# EAGLE design Seeeduino_XIAO_Expansion_board_v1.0_200824 (EAGLE 9.3.1)
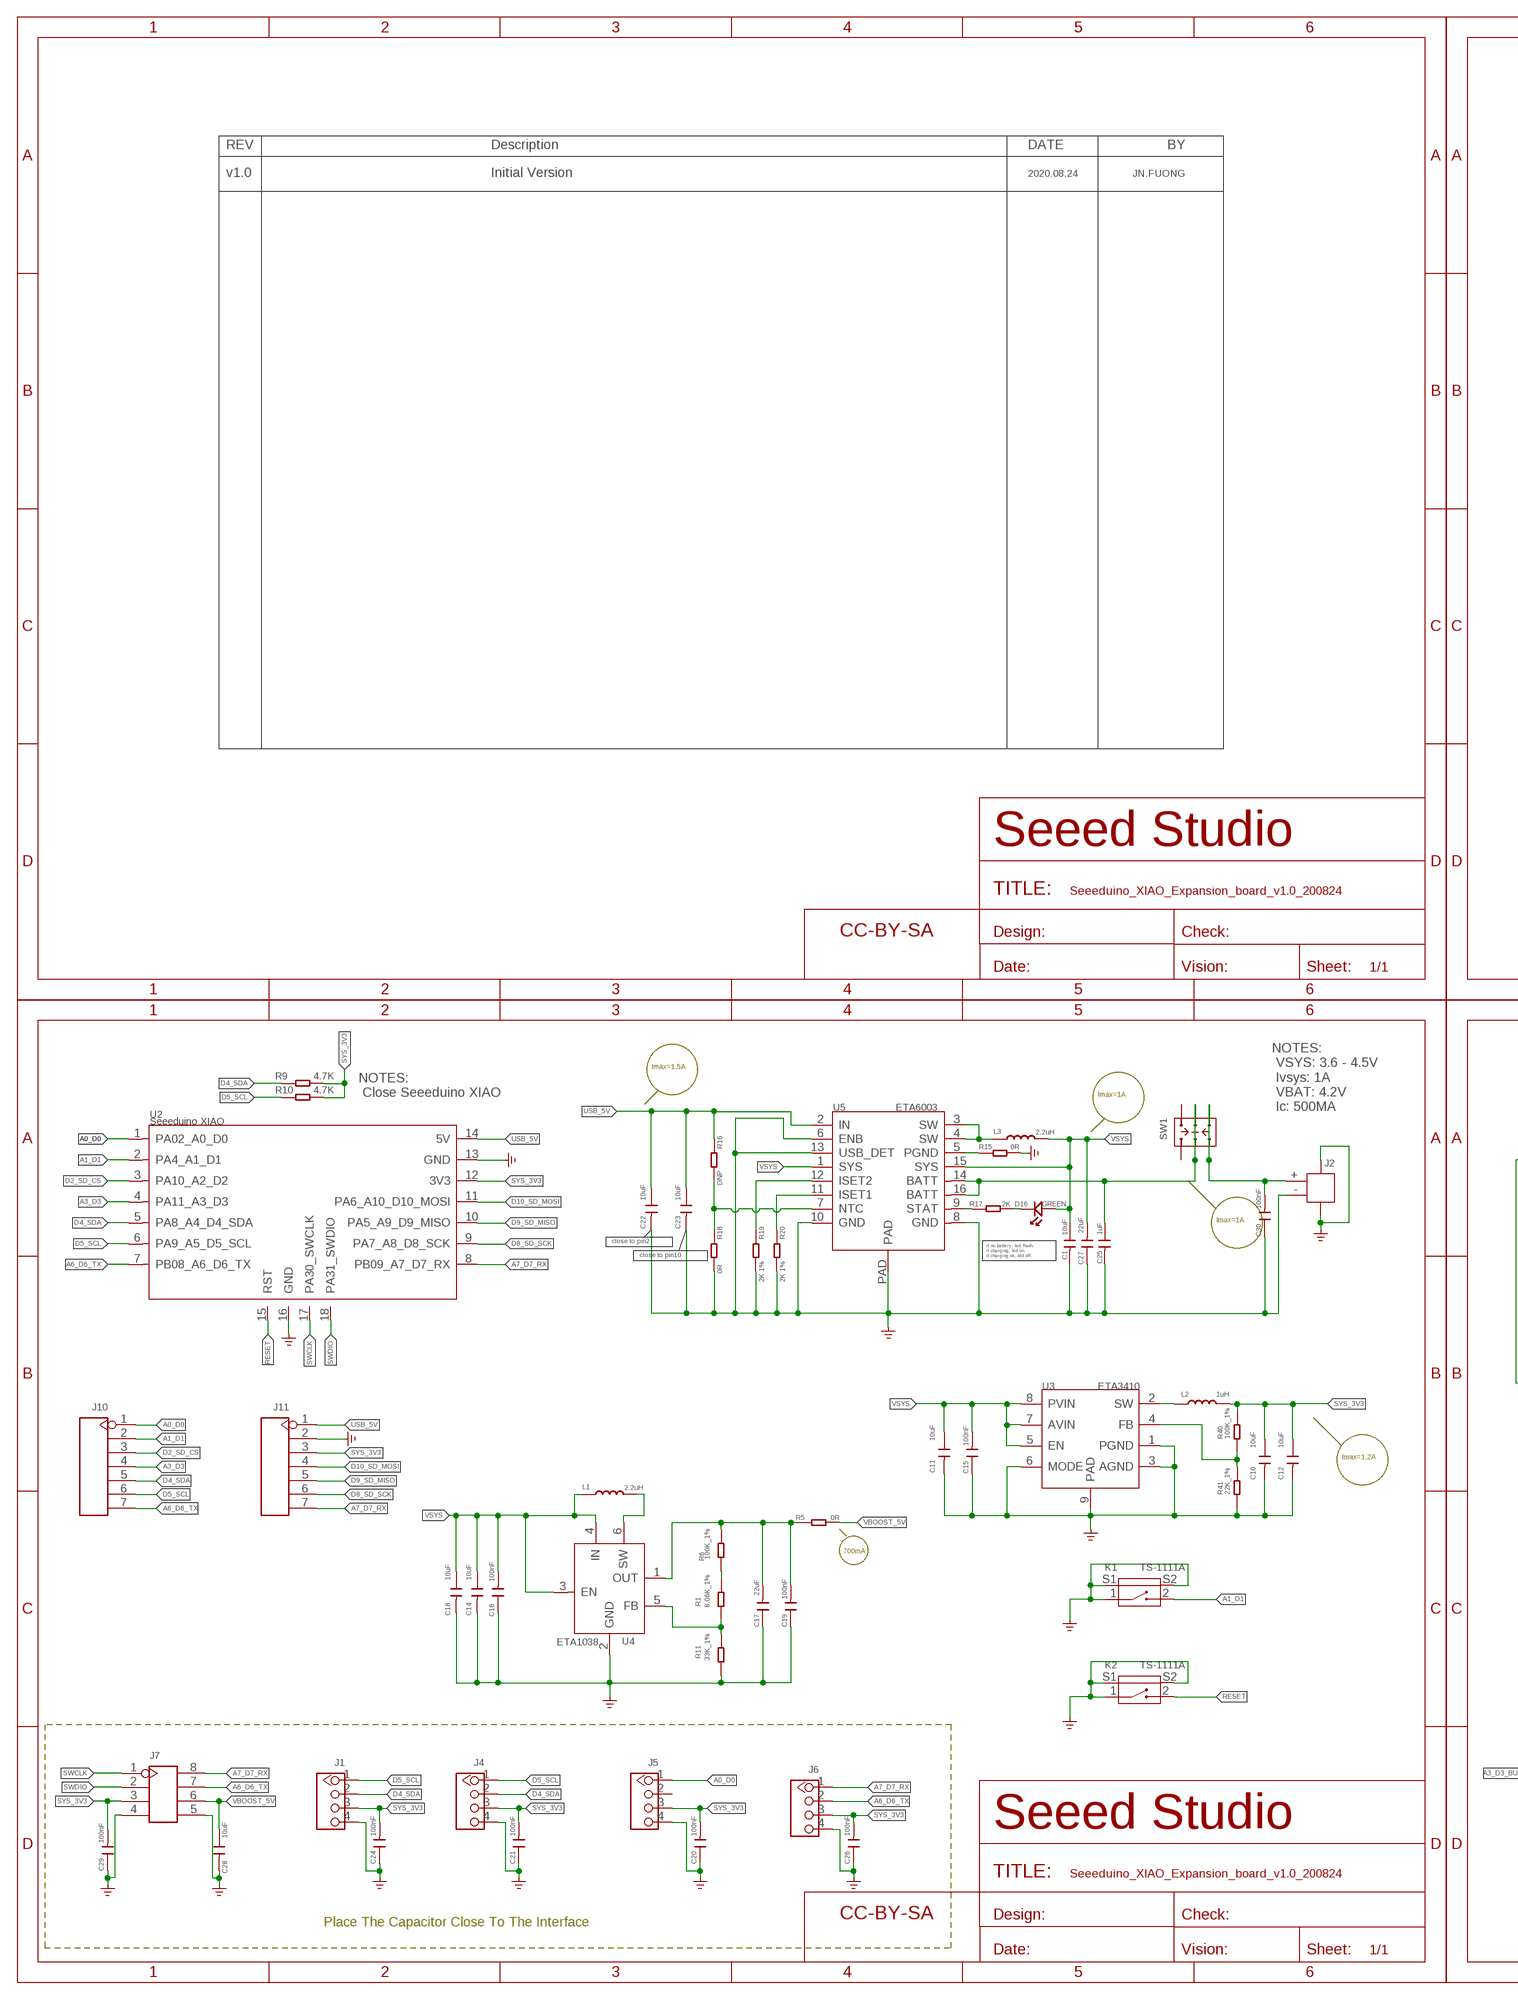
[diagram p0: schematic, sheet 1, part 1 of 2]
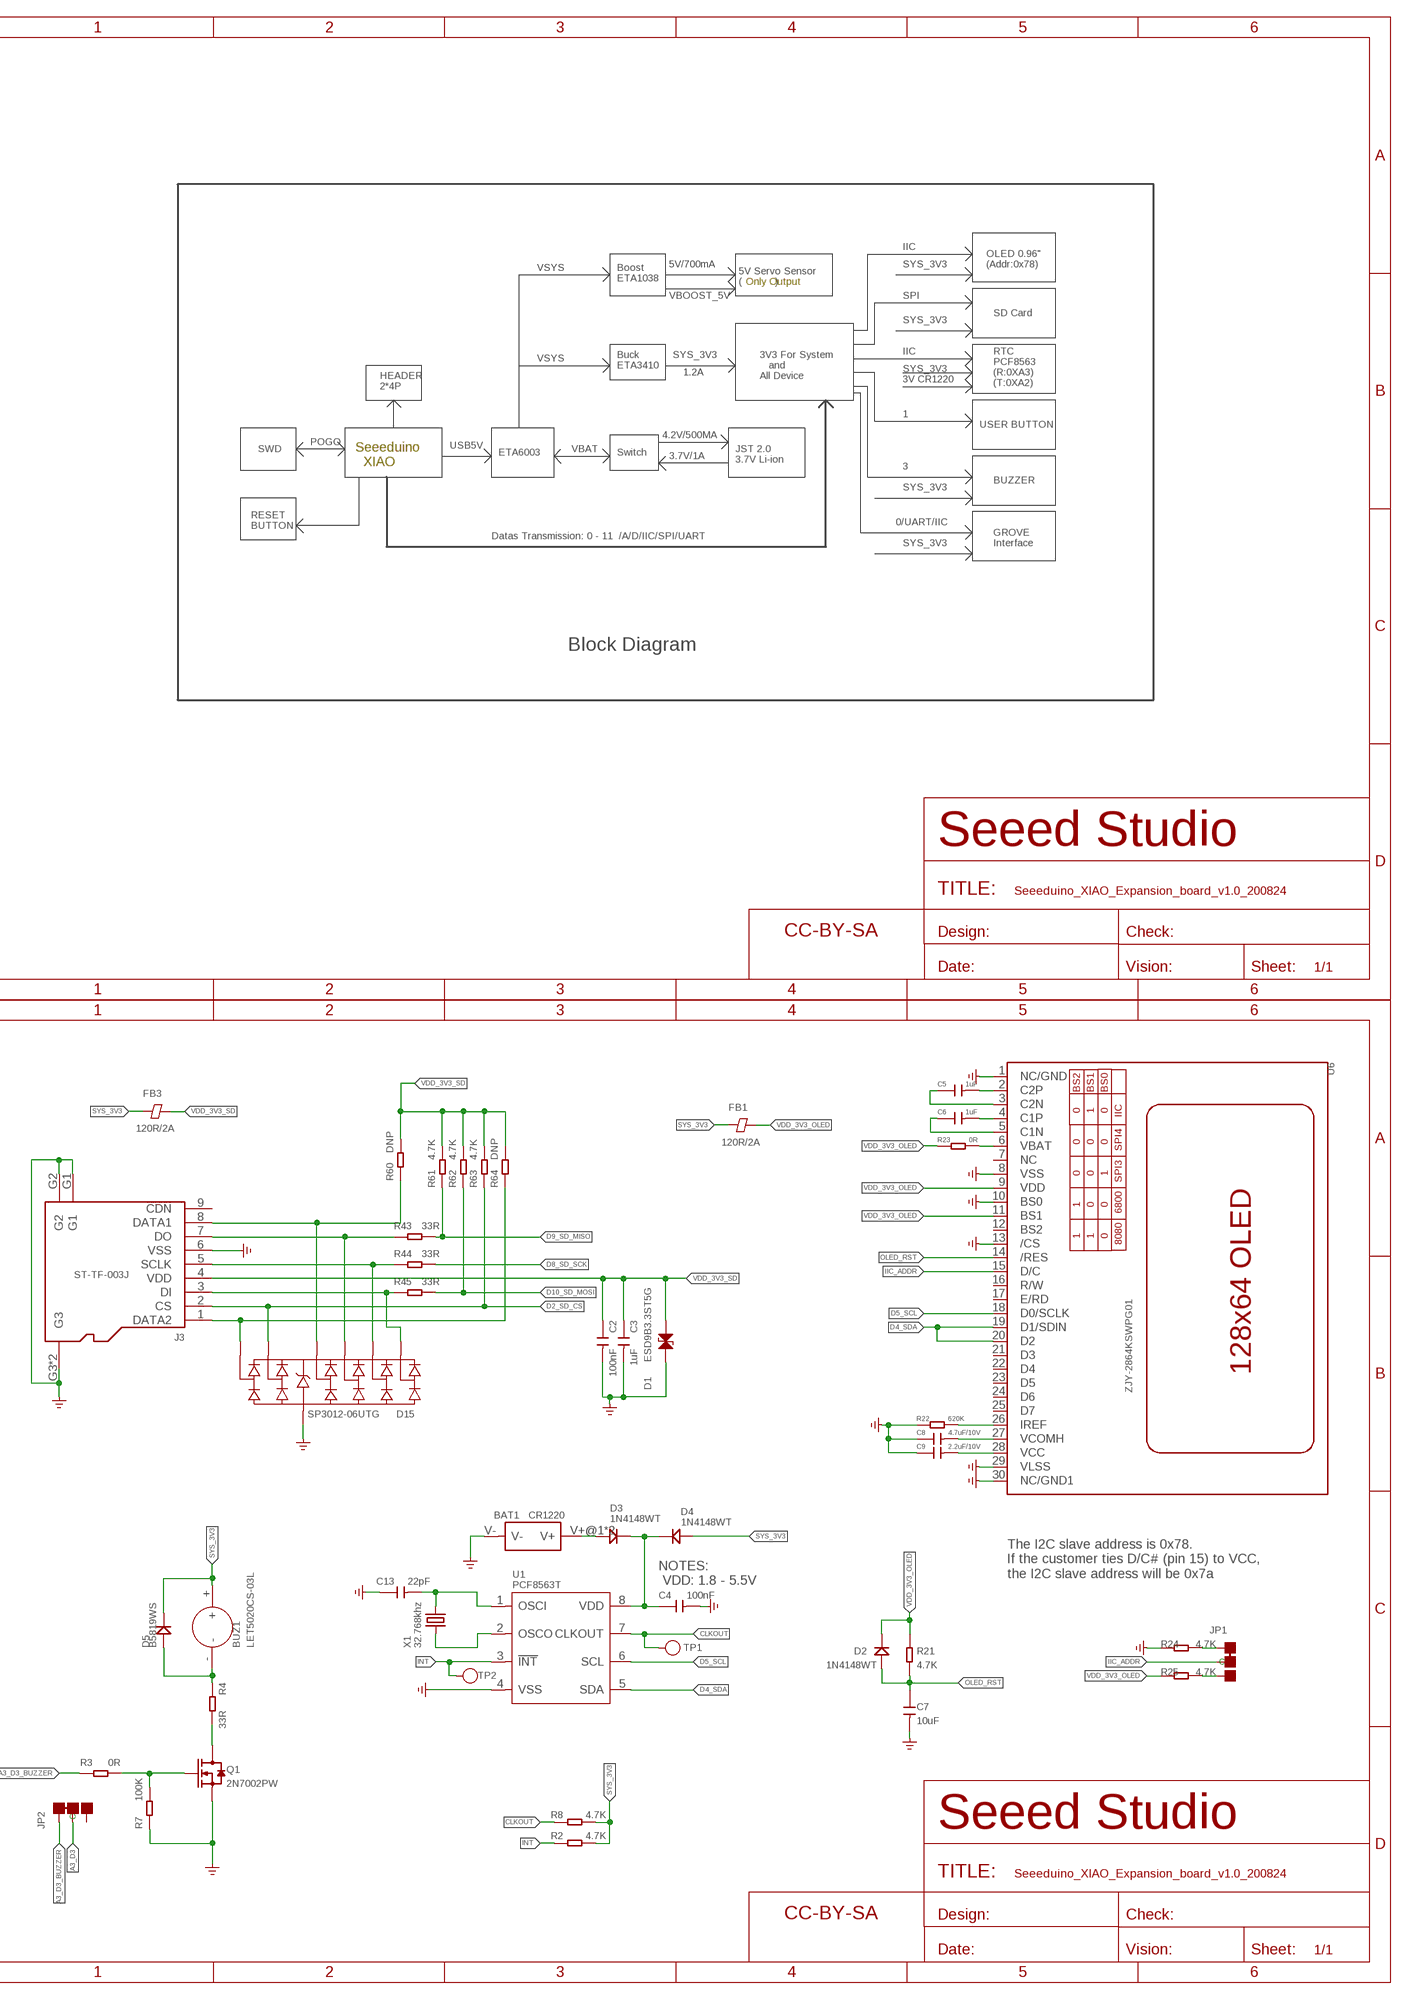
[diagram p1: schematic, sheet 1, part 2 of 2]

## Parts
BAT1  CR1220  BAT-HOLDER-KST-1206  [BAT2P-SMD-13.2X12.1X3.2MM]
BUZ1  LET5020CS-03L  BUZZER-312020004  [BZ3-SMD-5.0X5.0X2.5MM]
C1  10uF  C-0603  [C0603]
C2  100nF  C-0402  [C0402]
C3  1uF  C-0402  [C0402]
C4  100nF  C-0402  [C0402]
C5  1uF  C-0402  [C0402]
C6  1uF  C-0402  [C0402]
C7  10uF  C-0603  [C0603]
C8  4.7uF/10V  C-0603  [C0603]
C9  2.2uF/10V  C-0603  [C0603]
C10  10uF  C-0603  [C0603]
C11  10uF  C-0603  [C0603]
C12  10uF  C-0603  [C0603]
C13  22pF  C-0402  [C0402]
C14  10uF  C-0603  [C0603]
C15  100nF  C-0402  [C0402]
C16  100nF  C-0402  [C0402]
C17  22uF  C-0603  [C0603]
C18  10uF  C-0603  [C0603]
C19  100nF  C-0402  [C0402]
C20  100nF  C-0402  [C0402]
C21  100nF  C-0402  [C0402]
C22  10uF  C-0603  [C0603]
C23  10uF  C-0603  [C0603]
C24  100nF  C-0402  [C0402]
C25  1uF  C-0402  [C0402]
C26  100nF  C-0402  [C0402]
C27  22uF  C-0603  [C0603]
C28  10uF  C-0603  [C0603]
C29  100nF  C-0402  [C0402]
C30  100nF  C-0603  [C0603]
D1  ESD9B3.3ST5G  D-ESD-2P-DOUBLE-0402  [ESD-0402]
D2  1N4148WT  DIODE'0603'  [SOD-523]
D3  1N4148WT  DIODE'0603'  [SOD-523]
D4  1N4148WT  DIODE'0603'  [SOD-523]
D5  B5819WS  DIODE'0805'  [SOD-323]
D15  SP3012-06UTG  D-ESD-14P  [UDFN14-0.5-3.5X1.35X0.5MM]
D16  GREEN  LED-0402  [LED-0402]
FB1  120R/2A  FERRITE-BEAD-0402  [F0402]
FB3  120R/2A  FERRITE-BEAD-0402  [F0402]
FR1  SEEEDSTUDIO-OPEN-SCH-FRAME  [SEEEDSTUDIO-PCB-FRAME]
FR2  SEEEDSTUDIO-OPEN-SCH-FRAME  [SEEEDSTUDIO-PCB-FRAME]
FR3  SEEEDSTUDIO-OPEN-SCH-FRAME  [SEEEDSTUDIO-PCB-FRAME]
FR5  SEEEDSTUDIO-OPEN-SCH-FRAME  [SEEEDSTUDIO-PCB-FRAME]
J1  GROVE-CONNECTOR-DIP-320110034  [HW4-2.0-90D]
J2  JST-2P-SMD'2.0'  [HW2-SMD-2.0-90D]
J3  ST-TF-003J  MICRO-SD-CARD-HOLDER-9P-320090000  [MICRO-SD9+4P-SMD-16.1X14.5X1.85MM]
J4  GROVE-CONNECTOR-DIP-320110034  [HW4-2.0-90D]
J5  GROVE-CONNECTOR-DIP-320110034  [HW4-2.0-90D]
J6  GROVE-CONNECTOR-DIP-320110034  [HW4-2.0-90D]
J7  HEADER-2X4P-2.54-SMD  [H2X4-SMD-2.54]
J10  HEADER-7P-2.54  [H7-2.54]
J11  HEADER-7P-2.54  [H7-2.54]
JP1  JP-3P-SHORT  [3P-SMD-SHORT]
JP2  JP-3P-SHORT  [3P-SMD-SHORT]
K1  TS-1111A  BUTTON-2+2P'HQ-TP-1100A'  [SW4-SMD-4.5X3.8X1.8MM-90D]
K2  TS-1111A  BUTTON-2+2P'HQ-TP-1100A'  [SW4-SMD-4.5X3.8X1.8MM-90D]
L1  2.2uH  INDUCTOR/FERRITE-BEAD'0806'  [L0806]
L2  1uH  L-MPM201610SR33_T  [L201610]
L3  2.2uH  INDUCTOR/FERRITE-BEAD'0806'  [L0806]
Q1  2N7002PW  MOSFET-N-SI1304BDL  [SOT-323]
R1  8.06K_1%  R-0402  [R0402]
R2  4.7K  R-0402  [R0402]
R3  0R  R-0402  [R0402]
R4  33R  R-0402  [R0402]
R5  0R  R-0603  [R0603]
R6  100K_1%  R-0402  [R0402]
R7  100K  R-0402  [R0402]
R8  4.7K  R-0402  [R0402]
R9  4.7K  R-0402  [R0402]
R10  4.7K  R-0402  [R0402]
R11  33K_1%  R-0402  [R0402]
R15  0R  R-0402  [R0402]
R16  DNP  R-0402  [R0402]
R17  2K  R-0402  [R0402]
R18  0R  R-0402  [R0402]
R19  2K 1%  R-0402  [R0402]
R20  2K 1%  R-0402  [R0402]
R21  4.7K  R-0402  [R0402]
R22  620K  R-0402  [R0402]
R23  0R  R-0402  [R0402]
R24  4.7K  R-0402  [R0402]
R25  4.7K  R-0402  [R0402]
R40  100K_1%  R-0402  [R0402]
R41  22K_1%  R-0402  [R0402]
R43  33R  R-0402  [R0402]
R44  33R  R-0402  [R0402]
R45  33R  R-0402  [R0402]
R60  DNP  R-0402  [R0402]
R61  4.7K  R-0402  [R0402]
R62  4.7K  R-0402  [R0402]
R63  4.7K  R-0402  [R0402]
R64  DNP  R-0402  [R0402]
SW1  SWITCH-2CH-6P-311030004  [SW6-2.54-9.0X3.5X3.2MM-90D]
TP1  TEST-POINT'4545'  [TP-D45MIL]
TP2  TEST-POINT'4545'  [TP-D45MIL]
U1  PCF8563T  RTC-PCF8563T  [SOP8-1.27-5X3.9MM]
U2  Seeeduino XIAO  MOUDLE-SEEEDUINO-XIAO-TEST-DIP  [MOUDLE14P-2.54-21X17.8MM-TEST]
U3  ETA3410  CONVERTER-ETA3410  [DFN8G-0.5-2X2MM]
U4  ETA1038  CONVERTER-ETA1038  [SOT-23-6]
U5  ETA6003  PMIC-ETA6003-310990023  [QFN16GA-0.5-3X3MM]
U6  ZJY-2864KSWPG01  OLED-12864-30P  [OLED30P-0.7-24.74X16.9MM]
X1  32.768khz  CRYSTAL-2P'NX2012SA'  [X2-SMD-L2.0X1.2X0.55MM]

## Nets
A0_D0: J5.1 J10.1 U2.1(PA02_A0_D0)
A1_D1: J10.2 K1.2 U2.2(PA4_A1_D1)
A3_D3: J10.4 JP2.MM(C) U2.4(PA11_A3_D3)
A3_D3_BUZZER: JP2.11(L) R3.1
A6_D6_TX: J6.2 J7.7 J10.7 U2.7(PB08_A6_D6_TX)
A7_D7_RX: J6.1 J7.8 J11.7 U2.8(PB09_A7_D7_RX)
CLKOUT: R8.1 TP1.T U1.7(CLKOUT)
D2_SD_CS: D15.6 D15.9 J3.2(CS) J10.3 R63.1 U2.3(PA10_A2_D2)
D4_SDA: J1.2 J4.2 J10.5 R9.1 U1.5(SDA) U2.5(PA8_A4_D4_SDA) U6.19(D1/SDIN) U6.20(D2)
D5_SCL: J1.1 J4.1 J10.6 R10.1 U1.6(SCL) U2.6(PA9_A5_D5_SCL) U6.18(D0/SCLK)
D8_SD_SCK: J11.6 R44.2 U2.9(PA7_A8_D8_SCK)
D9_SD_MISO: J11.5 R43.2 R61.1 U2.10(PA5_A9_D9_MISO)
D10_SD_MOSI: J11.4 R45.2 R62.1 U2.11(PA6_A10_D10_MOSI)
E_VBAT: C30.2 J2.+ SW1.CH1B SW1.CH2B
GND: BAT1.V- C1.2 C2.2 C3.2 C4.2 C7.2 C8.1 C9.1 C10.2 C11.2 C12.2 C13.1 C14.2 C15.1 C16.1 C17.1 C18.2 C19.1 C20.1 C21.1 C22.2 C23.2 C24.1 C25.2 C26.1 C27.1 C28.2 C29.1 C30.1 D1.1 D15.5 D15.10 J1.4 J2.3 J2.4 J2.- J3.6(VSS) J3.G1 J3.G2 J3.G3 J3.G4(G3) J4.4 J5.4 J6.4 J7.4 J7.5 J11.2 K1.1 K1.S1 K1.S2 K2.1 K2.S1 K2.S2 Q1.2(S) R7.1 R11.2 R15.2 R18.2 R19.2 R20.2 R22.2 R24.1 R41.1 U1.4(VSS) U2.13(GND) U2.16(GND) U3.1(PGND) U3.3(AGND) U3.6(MODE) U3.9(PAD) U4.2(GND) U5.6(ENB) U5.8(GND) U5.10(GND) U5.13(USB_DET) U5.PAD U6.1(NC/GND) U6.8(VSS) U6.10(BS0) U6.13(/CS) U6.29(VLSS) U6.30(NC/GND1) ; supply symbol labelled GND_POWER
IIC_ADDR: JP1.MM(C) U6.15(D/C)
INT: R2.1 TP2.T U1.3(!INT)
N$1: L1.2 U4.6(SW)
N$5: BAT1.V+@1(V+) BAT1.V+@2(V+) D3.+
N$6: Q1.3(D) R4.2
N$7: BUZ1.- D5.+ R4.1
N$8: Q1.1(G) R3.2 R7.2
N$9: C5.2 U6.2(C2P)
N$10: C13.2 U1.1(OSCI) X1.2
N$11: U1.2(OSCO) X1.1
N$12: C6.2 U6.4(C1P)
N$13: C5.1 U6.3(C2N)
N$14: C6.1 U6.5(C1N)
N$15: R22.1 U6.26(IREF)
N$16: C8.2 U6.27(VCOMH)
N$17: C9.2 U6.28(VCC)
N$18: R23.2 U6.6(VBAT)
N$19: JP1.11(L) R24.2
N$20: JP1.00(R) R25.2
N$21: R40.1 R41.2 U3.4(FB)
N$22: C17.2 C19.2 R5.2 R6.1 U4.1(OUT)
N$23: C4.1 D3.- D4.- U1.8(VDD)
N$24: R1.1 R6.2
N$26: L3.1 U5.3(SW) U5.4(SW)
N$27: R1.2 R11.1 U4.5(FB)
N$29: L2.1 U3.2(SW)
N$30: D16.- R17.1
N$31: R17.2 U5.9(STAT)
N$33: R16.2 R18.1 U5.7(NTC)
N$34: R20.1 U5.11(ISET1)
N$36: R19.1 U5.12(ISET2)
N$37: R15.1 U5.5(PGND)
N$64: D15.1 D15.14 J3.8(DATA1) R60.1
N$72: D15.7 D15.8 J3.1(DATA2) R64.1
N$76: D15.2 D15.13 J3.7(DO) R43.1
N$77: D15.3 D15.12 J3.5(SCLK) R44.1
N$78: D15.4 D15.11 J3.3(DI) R45.1
OLED_RST: C7.1 D2.+ R21.1 U6.14(/RES)
RESET: K2.2 U2.15(RST)
SWCLK: J7.1 U2.17(PA30_SWCLK)
SWDIO: J7.2 U2.18(PA31_SWDIO)
SYS_3V3: BUZ1.+ C10.1 C12.1 C20.2 C21.2 C24.2 C26.2 C29.2 D4.+ D5.- FB1.1 FB3.1 J1.3 J4.3 J5.3 J6.3 J7.3 J11.3 L2.2 R2.2 R8.2 R9.2 R10.2 R40.2 U2.12(3V3)
USB_5V: C22.1 C23.1 J11.1 R16.1 U2.14(5V) U5.2(IN)
VBAT: C25.1 SW1.COM1 SW1.COM2 U5.14(BATT) U5.16(BATT)
VBOOST_5V: C28.1 J7.6 R5.1
VDD_3V3_OLED: D2.- FB1.2 R21.2 R23.1 R25.1 U6.9(VDD) U6.11(BS1)
VDD_3V3_SD: C2.1 C3.1 D1.2 FB3.2 J3.4(VDD) R60.2 R61.2 R62.2 R63.2 R64.2
VSYS: C1.1 C11.1 C14.1 C15.2 C16.2 C18.1 C27.2 D16.+ L1.1 L3.2 U3.5(EN) U3.7(AVIN) U3.8(PVIN) U4.3(EN) U4.4(IN) U5.1(SYS) U5.15(SYS)
Unconnected: J3.9(CDN) J5.2 JP2.00(R) SW1.CH1A SW1.CH2A U6.7(NC) U6.12(BS2) U6.16(R/W) U6.17(E/RD) U6.21(D3) U6.22(D4) U6.23(D5) U6.24(D6) U6.25(D7)

## Notes on the sheet
- v1.0 | Initial Version | 2020.08.24 | JN.FUONG
- IIC
- VSYS
- 5V/700mA | SYS_3V3
- OLED 0.96"
  (Addr:0x78)
- Boost
  ETA1038
- 5V Servo Sensor
  (           )
- Only Output
- VBOOST_5V | SPI
- SD Card
- SYS_3V3
- VSYS | IIC
- SYS_3V3
- Buck
  ETA3410
- SYS_3V3
- 1.2A
- 3V3 For System
     and
  All Device
- 3V CR1220
- RTC
  PCF8563
  (R:0XA3)
  (T:0XA2)
- HEADER
  2*4P
- 1
- USER BUTTON
- 4.2V/500MA
- POGO
- USB5V
- SWD | VBAT
- ETA6003 | Switch
- 3.7V/1A
- JST 2.0
  3.7V Li-ion
- Seeeduino
    XIAO
- 3
- BUZZER
- SYS_3V3
- 0/UART/IIC
- RESET
  BUTTON
- Datas Transmission: 0 - 11  /A/D/IIC/SPI/UART
- SYS_3V3
- GROVE
  Interface
- Block Diagram
- Imax=1.5A
- NOTES:
   Close Seeeduino XIAO
- Imax=1A
- NOTES:
   VSYS: 3.6 - 4.5V
   Ivsys: 1A
   VBAT: 4.2V
   Ic: 500MA
- Imax=1A
- close to pin2
- close to pin10
- if no battery, led flash.
  if charging, led on.
  if charging ok, led off.
- Imax=1.2A
- 700mA
- The I2C slave address is 0x78.
  If the customer ties D/C# (pin 15) to VCC,
  the I2C slave address will be 0x7a
- NOTES:
   VDD: 1.8 - 5.5V
- Place The Capacitor Close To The Interface

## Library data of the parts
BAT1 = Connector-new:BAT-HOLDER: BAT2P-13.5-CR1220:320170002;BAT2P-SMD-20.5-CR1632:320170007;METAL-CR2032-D20.0*H6.3MM:320170003;METAL-CR2032-SMD:320170006;PLASTIC-CR1220-L15.06*W13.0*H4.1MM:320170000;PLASTIC-CR2032-L25.2*W15.6*H5.2MM:320170005;BAT2P-11.55-D12.55-CR1220:313010022
BUZ1 = Discrete-new:BUZZER
C1-C30 = Discrete-small:C*: Ceramic Capacitors
D1 = Discrete-small:D-ESD-2P-DOUBLE
D2-D5 = Discrete-new:DIODE
D15 = Discrete-new:D-ESD-14P
D16 = Discrete-small:LED
FB1 FB3 = Discrete-new:FERRITE-BEAD
FR1-FR3 FR5 = moudle-new:SEEEDSTUDIO-OPEN-SCH-FRAME
J1 J4-J6 = Connector-new:GROVE-CONNECTOR-DIP
J2 = Connector-new:JST-2P-SMD
J3 = Connector-new:MICRO-SD-CARD-HOLDER-9P; SKU: 320090000
J7 = Connector-new:HEADER-2X4P
J10 J11 = Connector-new:HEADER-7P
JP1 JP2 = Discrete-new:JP-3P-SHORT
K1 K2 = Discrete-new:BUTTON-2+2P: SW4-SMD-4.5X3.8X1.8MM-90D:311020035;SW4-SMD-7.0X3.5X3.5MM-90D:311020023
L1 L3 = Discrete-new:INDUCTOR/FERRITE-BEAD
L2 = Discrete-new:L
Q1 = Discrete-new:MOSFET-N: IRLL014: http://www.vishay.com/docs/91319/sihll014.pdf
R1-R11 R15-R25 R40 R41 R43-R45 R60-R64 = Discrete-small:R*
SW1 = Switch:SWITCH-2CH-6P
TP1 TP2 = Discrete-new:TEST-POINT; PARTNO: DNP
U1 = IC-new:RTC-PCF8563T
U2 = moudle-new:MOUDLE-SEEEDUINO-XIAO-TEST
U3 = IC-new:CONVERTER-ETA3410: 3MHZ 2A High Step-Down Converter in DFN2x2-8L Package
U4 = IC-new:CONVERTER-ETA1038
U5 = IC-new:PMIC-ETA6003
U6 = moudle-new:OLED-128*64-30P: 308020008
X1 = Discrete-new:CRYSTAL-2P

## Board
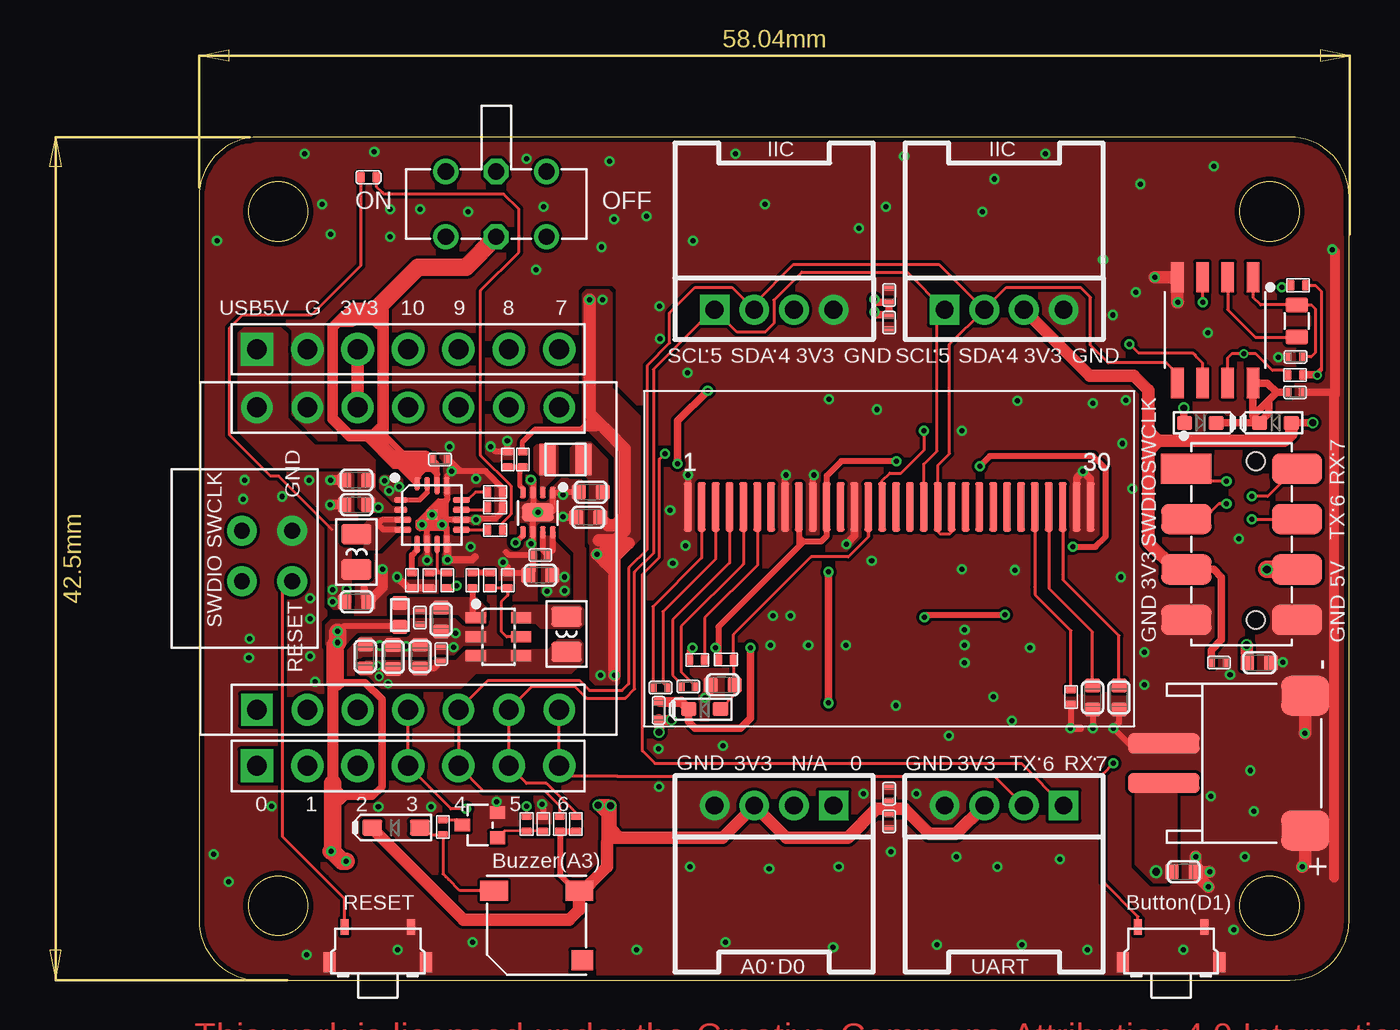
[diagram p2: board, top side]
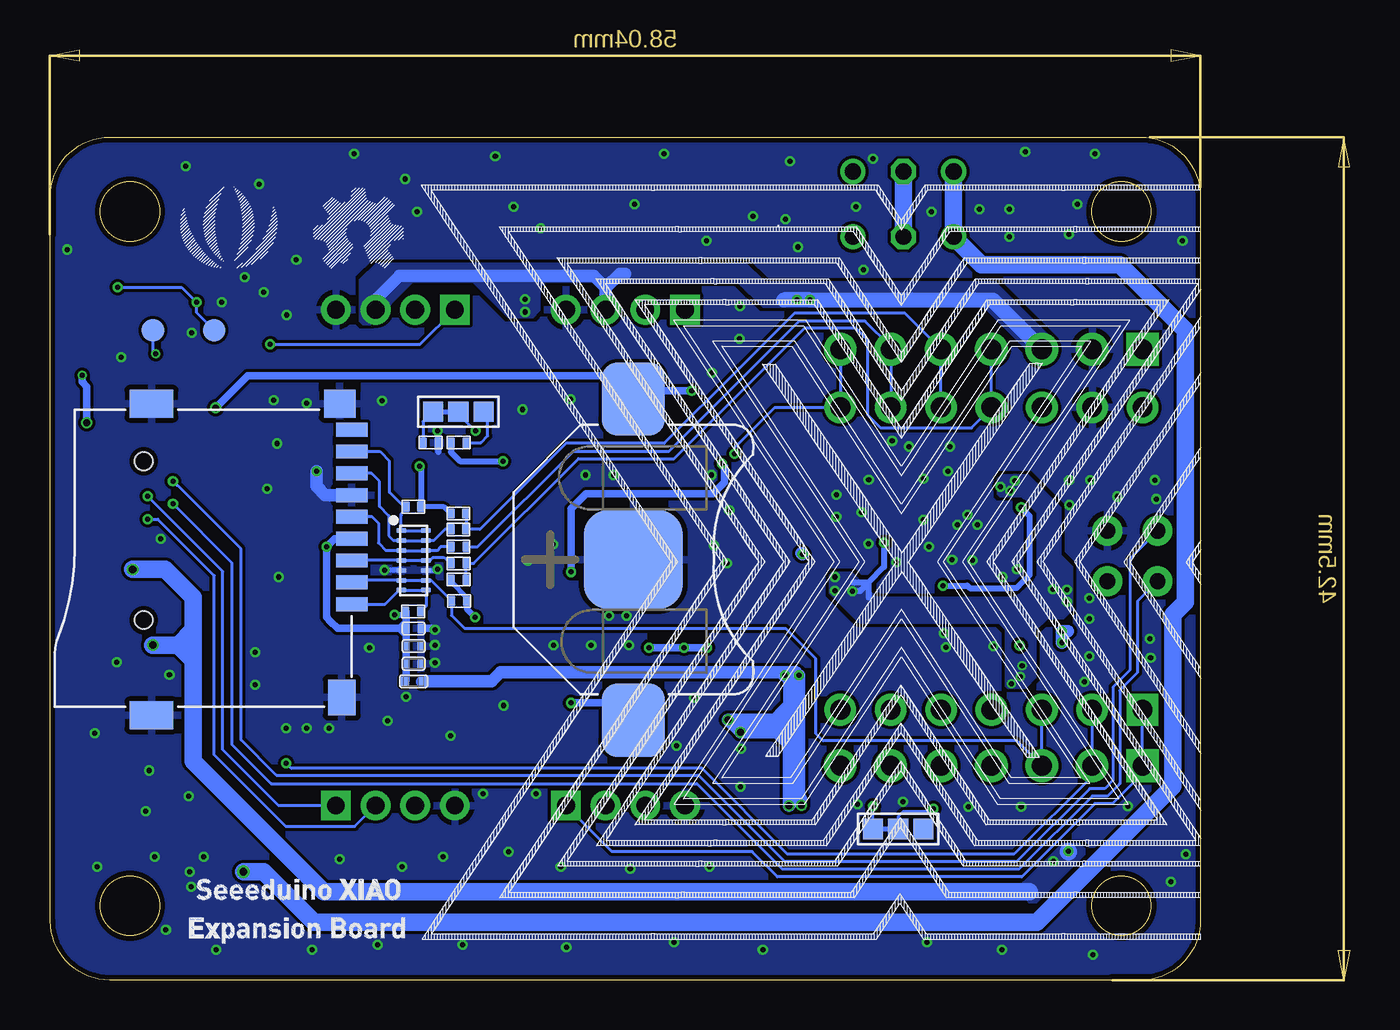
[diagram p3: board, bottom side, seen from below]

Size 58 x 42.5 mm. Coordinates in mm from the lower left corner, seen from the top.
Outline: 55,42.5 3,42.5 arc90 0,39.5 0,3 arc90 3,0 55,0 arc90 58,3 58,39.5 arc90 55,42.5
Outline: circle at 3.99,38.75 radius 1.5
Outline: circle at 53.99,38.75 radius 1.5
Outline: circle at 53.99,3.75 radius 1.5
Outline: circle at 3.99,3.75 radius 1.5
Copper layers (1*16): Top 0.035mm / dielectric 1.5mm / Bottom 0.035mm
Design rules "SeeedStudio_2layer_DRU_no_angle_20140221": minimum track width 1mil, minimum drill 10mil, track to track 6mil, track to pad 6mil, pad to pad 6mil, via to via 6mil, smd to smd 0mil, copper to edge 10mil, drill to drill 10mil, minimum pad ring 4mil, minimum via ring 4mil, stop-mask expansion 2mil, vias tented up to drill 25mil, thermal gap 10mil

### Footprints (pad centres in the part's own frame; a part is rotated, then mirrored left to right if it is on the bottom)
BAT2P-SMD-13.2X12.1X3.2MM = smd 3.7 x 3.2: V+@1 -8.1,0; V+@2 8.1,0 | smd 5 x 5: V- 0,0
BZ3-SMD-5.0X5.0X2.5MM = smd 1.4 x 1: + -2.15,-1.75; - 2.15,-1.75 | smd 1.1 x 1: NC -2.3,1.75
C0603 = smd 0.762 x 0.696: 1 0,0.602; 2 0,-0.602
C0402 = smd 0.508 x 0.385: 1 0,0.383; 2 0,-0.383
ESD-0402 = smd 0.385 x 0.508: 1 0.383,0; 2 -0.383,0
SOD-523 = smd 0.762 x 0.7: + 0.8,0; - -0.8,0
SOD-323 = smd 1 x 0.8: + 1.2,0; - -1.2,0
UDFN14-0.5-3.5X1.35X0.5MM = smd 0.25 x 0.5: 1 -1.5,-0.625; 2 -1,-0.625; 3 -0.5,-0.625; 4 0,-0.625; 5 0.5,-0.625; 6 1,-0.625; 7 1.5,-0.625; 8 1.5,0.625; 9 1,0.625; 10 0.5,0.625; 11 0,0.625; 12 -0.5,0.625; 13 -1,0.625; 14 -1.5,0.625
LED-0402 = smd 0.385 x 0.508: + -0.383,0; - 0.383,0
F0402 = smd 0.445 x 0.508: 1 -0.445,0; 2 0.445,0
HW4-2.0-90D = drill 0.9 pad 1.5 square: 1 -3,0 | drill 0.9 pad 1.5: 2 -1,0; 3 1,0; 4 3,0
HW2-SMD-2.0-90D = smd 2 x 2.4: 3 3.4,-2.181; 4 -3.4,-2.181 | smd 1 x 3.6: + -1,4.953; - 1,4.953
MICRO-SD9+4P-SMD-16.1X14.5X1.85MM = smd 1.6 x 0.7: 1 0,2.25; 2 0,1.15; 3 0,0.05; 4 0,-1.05; 5 0,-2.15; 6 0,-3.25; 7 0,-4.35; 8 0,-5.45; 9 0,-6.55 | smd 1.6 x 1.4: G1 0.6,-7.85 | smd 2.2 x 1.4: G2 10.1,-7.85; G3 10.1,7.85 | smd 1.4 x 1.8: G4 0.5,6.95 | hole 0.9: 10.5,-4.95; 10.5,3.05
H2X4-SMD-2.54 = smd 2.54 x 1.524: 1 -2.794,3.81; 2 -2.794,1.27; 3 -2.794,-1.27; 4 -2.794,-3.81; 5 2.794,-3.81; 6 2.794,-1.27; 7 2.794,1.27; 8 2.794,3.81
H7-2.54 = drill 1 pad 1.651 square: 1 0,7.62 | drill 1 pad 1.651: 2 0,5.08; 3 0,2.54; 4 0,0; 5 0,-2.54; 6 0,-5.08; 7 0,-7.62
3P-SMD-SHORT = smd 1.016 x 1.016: 00 -1.27,0; 11 1.27,0; MM 0,0
SW4-SMD-4.5X3.8X1.8MM-90D = smd 0.4 x 0.8: 1 -1.675,-1.277; 2 1.675,-1.277 | smd 0.6 x 1: S1 -2.425,0.5; S2 2.425,0.5
L0806 = smd 1.016 x 1.524: 1 -0.889,0; 2 0.889,0
L201610 = smd 0.8 x 1.6: 1 -0.9,0; 2 0.9,0
SOT-323 = smd 0.762 x 0.635: 1 0.889,-0.635; 2 0.889,0.635; 3 -0.889,0
R0402 = smd 0.385 x 0.508: 1 0.383,0; 2 -0.383,0
R0603 = smd 0.696 x 0.762: 1 0.602,0; 2 -0.602,0
SW6-2.54-9.0X3.5X3.2MM-90D = drill 0.813 pad 1.27: CH1A -2.54,-1.65; CH1B 2.54,-1.65; CH2A -2.54,1.65; CH2B 2.54,1.65 | drill 0.813 pad 1.27 octagon: COM1 0,-1.65; COM2 0,1.65
TP-D45MIL = smd 1.143 x 1.143: T 0,0
SOP8-1.27-5X3.9MM = smd 0.635 x 1.524: 1 -1.905,-2.667; 2 -0.635,-2.667; 3 0.635,-2.667; 4 1.905,-2.667; 5 1.905,2.667; 6 0.635,2.667; 7 -0.635,2.667; 8 -1.905,2.667
MOUDLE14P-2.54-21X17.8MM-TEST = drill 1 pad 1.6 square: 1 7.62,7.62 | drill 1 pad 1.6: 2 5.08,7.62; 3 2.54,7.62; 4 0,7.62; 5 -2.54,7.62; 6 -5.08,7.62; 7 -7.62,7.62; 8 -7.62,-7.62; 9 -5.08,-7.62; 10 -2.54,-7.62; 11 0,-7.62; 12 2.54,-7.62; 13 5.08,-7.62; 14 7.62,-7.62 | drill 0.8 pad 1.5: 15 5.842,1.143; 16 5.842,-1.397; 17 8.382,-1.397; 18 8.382,1.143
DFN8G-0.5-2X2MM = smd 0.3 x 0.6: 1 -0.75,-1; 2 -0.25,-1; 3 0.25,-1; 4 0.75,-1; 5 0.75,1; 6 0.25,1; 7 -0.25,1; 8 -0.75,1 | smd 1.6 x 0.9: 9 0,0
SOT-23-6 = smd 0.55 x 1.016: 1 -0.95,-1.143; 2 0,-1.143; 3 0.95,-1.143; 4 0.95,1.143; 5 0,1.143; 6 -0.95,1.143
QFN16GA-0.5-3X3MM = smd 0.28 x 0.65: 1 -0.75,-1.575; 2 -0.25,-1.575 | smd 0.28 x 0.85: 3 0.25,-1.475; 4 0.75,-1.475; 9 0.75,1.475; 10 0.25,1.475; 11 -0.25,1.475; 12 -0.75,1.475 | smd 0.85 x 0.28: 5 1.475,-0.75; 6 1.475,-0.25; 7 1.475,0.25; 8 1.475,0.75; 13 -1.475,0.75; 14 -1.475,0.25 | smd 0.65 x 0.28: 15 -1.575,-0.25; 16 -1.575,-0.75 | smd 0.508 x 0.508: PAD 0,0
OLED30P-0.7-24.74X16.9MM = smd 0.4 x 2.5: 1 -10.15,2.604; 2 -9.45,2.604; 3 -8.75,2.604; 4 -8.05,2.604; 5 -7.35,2.604; 6 -6.65,2.604; 7 -5.95,2.604; 8 -5.25,2.604; 9 -4.55,2.604; 10 -3.85,2.604; 11 -3.15,2.604; 12 -2.45,2.604; 13 -1.75,2.604; 14 -1.05,2.604; 15 -0.35,2.604; 16 0.35,2.604; 17 1.05,2.604; 18 1.75,2.604; 19 2.45,2.604; 20 3.15,2.604; 21 3.85,2.604; 22 4.55,2.604; 23 5.25,2.604; 24 5.95,2.604; 25 6.65,2.604; 26 7.35,2.604; 27 8.05,2.604; 28 8.75,2.604; 29 9.45,2.604; 30 10.15,2.604
X2-SMD-L2.0X1.2X0.55MM = smd 0.762 x 1.143: 1 -0.813,0; 2 0.813,0

### Placement (x,y rotation side)
BAT1  28.6,21.2 270 bottom
BUZ1  17.02,2.76 180 top
C1  7.94,19.07 90 top
C2  39.68,16.84 90 bottom
C3  39.68,15.95 90 bottom
C4  55.27,29.63 90 top
C5  23.27,14.74 270 top
C6  24.67,14.8 270 top
C7  26.41,14.88 270 top
C8  45.06,14.24 180 top
C9  46.39,14.24 180 top
C10  19.62,23.33 270 top
C11  17.21,20.41 270 top
C12  19.75,24.6 270 top
C13  55.29,31.42 90 top
C14  9.79,16.29 180 top
C15  17.21,21.42 90 top
C16  12.21,16.44 0 top
C17  12.21,18.18 180 top
C18  11.15,16.31 180 top
C19  11.14,18.27 180 top
C20  34.8,34.54 0 top
C21  34.8,33.15 180 top
C22  7.94,25.19 270 top
C23  7.94,23.96 270 top
C24  34.8,8 180 top
C25  12.15,26.25 90 top
C26  34.8,9.4 0 top
C27  8.38,16.32 0 top
C28  53.47,16 90 top
C29  51.44,16 270 top
C30  49.66,5.46 270 top
D1  39.68,17.73 0 bottom
D2  25.5,13.66 0 top
D3  50.5,28.09 180 top
D4  54.28,28.09 0 top
D5  9.94,7.69 0 top
D15  39.68,21.16 270 bottom
D16  8.55,40.47 0 top
FB1  23.18,13.6 90 top
FB3  39.68,15.06 180 bottom
FR1  -0.25,-7.24 0 top  (outside the outline)
FR2  -0.25,-14.1 0 top  (outside the outline)
FR3  -0.25,-21.21 0 top  (outside the outline)
FR5  -0.51,-28.7 0 top  (outside the outline)
J1  40.6,33.8 0 top
J2  53.6,10.94 90 top
J3  42.8,21.2 180 bottom
J4  29,33.8 0 top
J5  29,8.8 180 top
J6  40.6,8.8 180 top
J7  52.58,21.97 0 top
J10  10.54,10.8 90 top
J11  10.54,31.8 90 top
JP1  37.43,28.66 180 bottom
JP2  15.24,7.62 180 bottom
K1  49.02,1.4 180 top
K2  9.02,1.4 180 top
L1  18.53,17.44 90 top
L2  18.48,26.25 0 top
L3  7.94,21.59 270 top
Q1  14.17,7.81 0 top
R1  14.67,20.15 90 top
R2  55.43,35.03 180 top
R3  16.52,7.87 90 top
R4  12.3,7.71 270 top
R5  10.13,18.4 270 top
R6  13.78,20.15 270 top
R7  17.35,7.87 90 top
R8  55.28,30.51 180 top
R9  18.2,7.87 90 top
R10  19.01,7.87 90 top
R11  15.56,20.15 270 top
R15  10.73,20.15 90 top
R16  12.51,20.15 270 top
R17  14.93,22.69 0 top
R18  11.62,20.15 90 top
R19  14.93,24.6 180 top
R20  14.93,23.84 180 top
R21  26.57,16.15 0 top
R22  43.97,14.27 90 top
R23  25.12,16.14 180 top
R24  38.82,27.09 0 bottom
R25  37.41,27.09 180 bottom
R40  16.32,26.25 270 top
R41  15.56,26.25 90 top
R43  37.43,22.73 180 bottom
R44  37.42,21.85 180 bottom
R45  37.41,21.01 180 bottom
R60  39.69,23.86 180 bottom
R61  37.42,23.52 0 bottom
R62  37.41,20.19 0 bottom
R63  37.39,19.11 180 bottom
R64  39.7,18.58 0 bottom
SW1  14.99,39.12 180 top
TP1  52.83,32.77 270 bottom
TP2  49.75,32.77 90 bottom
U1  51.24,32.77 180 top
U2  10.54,21.25 180 top
U3  17.09,23.58 180 top
U4  15.1,17.31 270 top
U5  11.75,23.45 270 top
U6  34.8,21.25 0 top
X1  55.35,33.22 90 top

### Tracks (layer width: path | path; a pad name or v marks a point on that pad's centre or on a via)
A0_D0
  Bottom 0.152: U2.1 J10.1 2.92,10.41 4.45,8.89 5.33,8.89 9.02,5.21 21.34,5.21 22.61,6.48 29.68,6.48 J5.1
A1_D1  (via drill 0.25 pad 0.51)
  Top 0.152: K1.2 47.35,3.2 45.59,4.95 45.59,10.41 v46.1,10.92
  Bottom 0.152: U2.2 J10.2 5.46,10.29 9.4,6.35 20.83,6.35 25.15,10.67 45.85,10.67 v46.1,10.92
A3_D3  (via drill 0.25 pad 0.51)
  Top 0.152: U2.4 J10.4 12.71,8.64 v13.46,8.64
  Bottom 0.152: JP2.MM 15.24,8.26 14.99,8.51 13.59,8.51 v13.46,8.64
A3_D3_BUZZER  (via drill 0.25 pad 0.51)
  Top 0.152: v16.51,8.76 R3.1
  Bottom 0.152: JP2.11 v16.51,8.76
A6_D6_TX  (via drill 0.25 pad 0.51)
  Top 0.152: U2.7 J10.7 18.67,10.29 21.08,10.29 40.11,10.29 J6.2 | v53.09,23.24 J7.7
  Bottom 0.152: v53.09,23.24 52.58,23.24 49.73,20.4 49.73,11.35 46.13,7.75 42.65,7.75 J6.2
A7_D7_RX  (via drill 0.25 pad 0.51)
  Top 0.152: v23.5,26.54 23.22,26.26 23.22,21.31 22.35,20.45 22.35,11.56 22.99,10.92 41.48,10.92 J6.1 | J7.8 55.29,25.78 53.89,24.38 v53.09,24.38
  Bottom 0.152: v23.5,26.54 23.5,26.84 21.46,28.87 U2.8 J11.7 | v53.09,24.38 49.3,20.6 49.3,11.61 46.49,8.8 J6.1
CLKOUT  (via drill 0.25)
  Top 0.152: R8.1 54.66,30.73 54.13,30.73 53.3,31.57 v52.69,31.57 v52.68,31.57 52.08,31.57 51.87,31.37 U1.7
  Bottom 0.152: TP1.T 52.83,31.72 v52.68,31.57
D2_SD_CS
  Bottom 0.152: J3.2 42.7,20.16 D15.6 D15.9 38.81,20.16 R63.1 37.77,18.39 37.11,17.73 20.92,17.73 19.41,16.22 19.41,12.45 19.02,12.06 9.27,12.06 J10.3 U2.3
D4_SDA
  Top 0.152: U2.5 J10.5 14.36,9.53 17.45,9.53 18.2,8.78 R9.1 | J1.2 37.85,32.05 37.85,26.54 37.25,25.95 U6.19 37.3,23.8 37.3,22.57 37.39,22.48 37.85,22.48 37.95,22.58 U6.20 | J1.2 37.33,36.07 29.96,36.07 28,34.1 J4.2 26.88,34.92 25.02,34.92 23.74,33.64 23.74,32.12 22.61,30.99 22.61,21.72 21.67,20.78 21.67,14.94 21.34,14.61 19.68,14.61 19.18,15.11 14.56,15.11 U2.5 | U2.5 | J1.2 40.73,34.92 44.45,34.92 44.96,34.42 44.96,32 45.85,31.11 48.77,31.11 49.33,30.55 U1.5
D5_SCL  (via drill 0.25 pad 0.51)
  Top 0.152: U1.6 50.6,31.11 50.32,31.4 50.23,31.49 50.09,31.62 47.37,31.62 46.95,32.05 v46.91,32.05 | U6.18 36.55,26.01 37.21,26.67 37.21,33.41 J1.1 35.71,35.69 30.4,35.69 28.99,34.28 28.99,33.11 28.55,32.67 27.13,32.67 J4.1 25.93,33.8 22.91,30.79 22.91,21.51 21.97,20.57 21.97,14.68 21.5,14.21 19.54,14.21 18.97,14.79 16.78,14.79 U2.6 J10.6 16.51,9.91 17.52,9.91 19.01,8.42 R10.1
  Bottom 0.152: v46.91,32.05 39.35,32.05 J1.1
D8_SD_SCK
  Bottom 0.152: R44.2 36.45,21.85 31.62,26.67 26.8,26.67 20.24,33.22 16.92,33.22 15.62,31.93 J11.6 U2.9
D9_SD_MISO
  Bottom 0.152: 23.25,30.85 27.05,27.05 32,27.05 36.33,22.73 R43.2 R61.1 | 23.25,30.85 20.48,33.62 14.9,33.62 J11.5 U2.10 | 23.25,30.85
D10_SD_MOSI
  Bottom 0.152: J11.4 U2.11 10.54,28.84 11.55,27.84 16.13,27.84 16.76,28.47 16.76,32.26 17.37,32.87 19.96,32.87 26.54,26.29 31.37,26.29 36.65,21.01 R45.2 R62.1
E_VBAT  (via drill 0.38 pad 0.64)
  Bottom 0.889: v48.26,5.46 47.24,5.46 44.7,2.92 8.26,2.92 1.4,9.78 1.4,18.41 0.76,19.05 0.76,32.77 4.06,36.07 11.05,36.07 SW1.CH2B SW1.CH1B
  pour Top (isolate 0.254, no thermals): 48.39,10.16 47.75,10.16 47.24,9.65 47.24,5.84 48.13,4.95 48.77,4.95 49.28,5.46 49.28,9.65 48.77,10.16
GND  (via drill 0.25 pad 0.51)
  Top 0.152: v11.5,21.18 v11.5,21.17
  Top 0.254: U5.13 12.5,25.43 v12.72,25.65 | U5.10 13.24,23.22 13.95,23.22 | R15.2 | U5.6 v11.5,21.18 | U3.6 16.84,22.09 v16.74,22 16.83,21.91 C15.1
  Top 0.305: 13.95,23.22 13.99,23.27 14.94,23.27 15.31,23.63 R20.2 R19.2 15.31,24.8 14.45,25.65 13.18,25.65 | 13.18,25.65 v12.72,25.65 12.72,26.11 13.18,25.65 | v16.73,25.23 16.84,25.12 U3.3 16.84,23.33 | U3.1 18.49,24.58 | 18.49,24.58 v18.36,24.46 18.24,24.58 U3.1 | C12.2 19.13,24.58 18.49,24.58 | v15.54,27.18 15.56,27.16 R41.1 15.54,26.64 14.96,26.64 v14.71,26.9 | v15.34,21.06 15.56,20.84 R11.2 16.48,20.54 C11.2 16.83,20.63 C15.1 15.64,21.42 15.47,21.59 | C7.2 25.81,14.5 v25.53,14.22 | U6.1 24.65,23.86 v24.65,25.46 | U6.8 29.56,25.42 v29.6,25.46 | U6.10 30.96,25.42 v31,25.46 | C9.1 46.39,12.99 v46.1,12.7 46.87,11.94 J2.- | C8.1 45.09,13.62 v45.09,12.7 | v43.94,12.7 43.97,12.7 R22.2 | C13.1 54.46,31.42 v54.43,31.39 | U3.6 16.84,23.33 | 16.84,23.33 U3.9 | U3.1 17.84,23.65 17.68,23.5 17.7,23.47 | U5.6 11.5,23.2 11.65,23.35 | 11.65,23.35 U5.PAD 12.5,24.2 12.5,24.43 U5.13 | U5.10 12.09,23.2 | 12.09,23.2 11.8,23.2 11.65,23.35 | U5.8 12.5,22.48 12.5,22.8 12.09,23.2 | v17.3,8.87 17.35,8.81 R7.1
  Top 0.381: C23.2 7.3,23.93 | 8.33,19.76 8.33,19.28 C1.2 | v9.98,20.32 10.53,19.77 R15.2 R18.2 | U6.29 44.26,25.34 v44.58,25.65 44.96,25.27 U6.30 | U6.13 33.06,22.39 v32.64,21.97 | C10.2 18.38,23.33 v18.35,23.36 | 13.92,21.34 13.77,21.19 v12.52,21.19 12.52,21.96 U5.8 | 44.45,12.7 43.97,12.7 | C4.2 57.2,29.63 57.24,29.59
  Top 0.508: C22.2 v6.62,25.19 | C23.2 7.33,23.95 v6.6,23.95 | v9.25,20.7 9.25,19.77 C1.2 | v57.15,36.83 57.28,36.7 57.28,29.55 57.24,29.59 57.24,5.17
  Top 0.61: C30.1 50.26,5.34 v50.9,4.7 | C30.1 v50.97,5.46 | C30.1 v50.26,6.21 v50.27,6.22
  Top 0.635: J2.3 55.78,12.47 v55.75,12.45 | J2.4 55.78,5.87 v55.63,5.71 | v49.35,34.16 49.33,34.18 U1.4 v48.21,35.43
  Bottom 0.254: D15.5 40.32,20.67 v41.15,20.67 | D15.10 38.53,20.66 v38.48,20.7 | R24.1 38.44,27.64 v38.48,27.69
  Bottom 0.305: R24.1 38.44,26.63
  Bottom 0.381: 38.66,15.95 v38.61,16 | D1.1 38.68,17.73
  Bottom 0.635: J3.6 44.13,24.45 44.58,24.89 v44.58,25.65
  other vias: 12.62,26.9 13.97,23.22 11.75,23.45 9.12,16.87 17.09,23.58 38.61,17.65 38.61,16.89 28.75,5.61 23.19,9.75 23.16,11.66 26.42,11.81 24.52,21.91 23.76,23.69 23.89,21.02 29.83,18.38 33.92,21.15 32.63,16.88 31.76,29.27 34.18,28.77 23.25,32.32 33.29,37.91 24.9,37.27 40.06,14.27 5.44,1.27 24.77,5.71 32.26,5.71 40.26,5.71 37.21,1.78 26.54,1.91 13.79,1.91 51.18,41.02 42.67,41.66 27.05,41.66 20.7,41.27 0.9,37.27 2.3,25.21 2.55,17.21 45.09,29.08 41.27,29.21 46.74,29.24 47.07,24.77 46.48,20.32 41.91,16.76 50.88,32.64 47.24,34.67 45.59,36.32 39.5,38.73 23.22,33.96 24.64,30.61 53.01,10.57 22.56,38.51 16.51,41.4 8.84,41.76 5.33,41.66 35.56,41.53 13.69,21.85 13.97,25.27 28.94,18.38 6.63,37.59 2.23,24.25 4.19,24.38 5.56,25.19 12.83,16.79 10.44,16.84 12.93,17.48 52.73,6.22 52.43,22.25 28.82,16.88 30.72,16.88 11.24,22.95 12.26,22.95 15.01,8.99 1.5,4.95 0.74,6.35 3.66,8.76 10.01,1.52 22.07,1.52 31.98,1.65 41.5,1.78 44.81,1.52 49.63,1.52 52.17,2.54 53.19,8.51 51.03,9.27 43.41,6.1 38.2,6.22 34.9,6.48 33.5,9.4 36.17,9.4 2.51,16.26 6.2,39.12 9.63,38.86 9.63,37.47 11.15,38.86 17.37,38.99 20.93,38.35 20.29,36.96 16.99,35.81 28.55,39.12 47.47,40.13 40.11,40.39 34.65,38.99 46.08,33.53 35.15,13.84 41,13.08 37.82,12.32 13.56,38.73 54.66,16.03 51.99,15.39 47.68,14.88 47.68,16.54 46.56,27.05 5.6,16.32 5.6,18.22 5.6,19.24 5.85,15.05 9.04,8.74 11.71,8.74
  pour Bottom (rank 6): -1.27,43.81 59.05,43.81 59.05,-0.64 -1.27,-0.64
  pour Top (rank 6, no thermals): -1.27,43.81 59.05,43.81 59.05,-0.64 -3.17,-0.64 -3.17,0.64 -1.27,0.64
  pour Top (no thermals): 14.22,17.65 13.21,17.65 12.83,18.03 10.92,18.03 10.92,17.53 10.67,17.27 9.14,17.27 8.89,17.02 8.89,16.64 9.02,16.51 11.81,16.51 11.94,16.64 12.95,16.64 13.34,17.02 14.22,17.02 14.35,17.14 14.35,17.53
IIC_ADDR  (via drill 0.25 pad 0.51)
  Top 0.152: v36.55,27.69 36.55,26.71 35.4,25.56 34.83,25.56 34.45,25.18 U6.15
  Bottom 0.152: JP1.MM 37.05,28.28 37.05,28.18 v36.55,27.69
INT  (via drill 0.25 pad 0.51)
  Top 0.152: v50.62,34.16 50.6,34.18 U1.3 | R2.1 54.71,35.03 v54.61,34.92
  Bottom 0.152: TP2.T 50.62,33.64 v50.62,34.16 51.38,34.92 v54.61,34.92
N$1
  pour Top (no thermals): 17.22,17.73 19.2,17.73 19.41,17.93 19.41,18.69 19.2,18.9 15.85,18.9 15.75,18.8 15.75,18.08 15.85,17.98 16.97,17.98
N$5  (via drill 0.25 pad 0.51, 0.35)
  Top 0.381: v31.75,20.57 v31.75,13.97 | v25.65,29.72 24.13,28.19 v24.13,26.04 | v49.67,28.84 49.67,28.12 D3.+
  Bottom 0.152: BAT1.V+@1 28.91,29.61
  Bottom 0.381: BAT1.V+@2 29.47,13.97 v31.75,13.97 | v24.13,26.04 24,25.91 24,25.09 24.59,24.51 30.99,24.51 31.75,23.75 v31.75,20.57 | BAT1.V+@1 28.18,29.72 v25.65,29.72 | 28.91,29.61 29.75,30.45 48.06,30.45 v49.67,28.84
N$6
  Top 0.152: R4.2 12.99,8.09 Q1.3
N$7
  Top 0.152: D5.+ 11.32,7.69 11.68,7.33 R4.1 12.3,5.35 12.45,5.21 12.57,5.08 13.15,4.51 BUZ1.-
N$8
  Top 0.152: Q1.1 15.4,7.52 R3.2 17.33,7.52 R7.2
N$9
  Top 0.152: C5.2 22.89,18.82 25.35,21.29 U6.2
N$10
  Top 0.152: U1.1 53.14,34.44 53.54,34.04 X1.2 56.09,34.04 56.28,33.85 56.28,31.62 56.08,31.42 C13.2
N$11
  Top 0.152: U1.2 51.87,33.8 53.26,32.41 X1.1
N$12
  Top 0.152: C6.2 24.28,14.96 23.88,15.37 23.88,18.16 26.75,21.04 U6.4
N$13
  Top 0.152: C5.1 23.39,14.99 23.39,18.57 26.05,21.22 U6.3
N$14
  Top 0.152: C6.1 24.31,15.53 24.31,17.84 27.45,20.97 U6.5
N$15
  Top 0.152: R22.1 43.97,17.62 42.16,19.44 42.16,19.81 42.15,19.82 U6.26
N$16
  Top 0.152: C8.2 45.06,17.55 42.86,19.75 42.86,20.45 U6.27
N$17
  Top 0.152: C9.2 46.39,17.36 43.56,20.19 43.56,20.45 U6.28
N$18
  Top 0.152: R23.2 25.5,18.26 28.15,20.91 U6.6
N$19
  Bottom 0.152: JP1.11 39.21,28.15 R24.2
N$20
  Bottom 0.152: JP1.00 35.94,28.44 35.94,27.43 36.28,27.09 R25.2
N$21
  Top 0.254: U3.4 16.34,24.76 16.17,24.92 16.17,25.71 R40.1 R41.2
N$22
  Top 0.305: R6.1 13.78,18.44 U4.1
  pour Top (no thermals): 9.78,19.3 13.97,19.3 14.48,18.8 14.48,18.29 14.22,18.03 13.46,18.03 13.08,18.41 9.78,18.41 9.65,18.54 9.65,19.18
N$23
  Top 0.381: C4.1 54.35,29.63 | 54.35,29.63 53.88,30.1 U1.8 53.14,28.42 53.96,29.23 | 53.96,29.23 53.96,28.57 D4.- D3.- | 54.35,29.63 53.96,29.23
N$24
  Top 0.305: R1.1 14.35,20.54 R6.2
N$26
  Top 0.305: U5.3 9.23,23.2 9.02,22.99 9.3,22.7 U5.4
  pour Top (no thermals): 9.93,23.32 8.66,23.32 8.31,22.96 8.31,21.79 8.41,21.69 9.07,21.69 9.93,22.56
N$27
  Top 0.152: U4.5 15.51,17.31 15.24,17.58 15.24,19.07 15.56,19.39 R11.1 R1.2
N$29
  pour Top (no thermals): 18.14,25.53 18.14,26.9 18.03,27 17.02,27 16.87,26.85 16.87,25.73 17.2,25.4 17.2,24.46 17.27,24.38 17.42,24.38 17.48,24.43 17.48,24.87
N$30
  Top 0.152: R17.1 15.31,23.07 15.73,23.49 15.73,24.91 14.2,26.44 14.2,34.77 16.13,36.7 16.13,38.86 15.37,39.62 9.31,39.62 9.23,39.71 8.93,40.01 D16.-
N$31
  Top 0.152: U5.9 14.53,22.7 R17.2
N$33
  Top 0.152: R18.1 11.81,20.54 | 11.81,20.54 12.01,20.54 | 12.01,20.54 12.17,20.54 | 12.17,20.54 R16.2 | 12.01,20.54 12,20.55 12,20.7 | U5.7 12,20.73 | 12,20.73 11.81,20.54 | 12,20.73 12,20.7 | 12,20.7 12.17,20.54
N$34
  Top 0.152: U5.11 14.41,23.7 R20.1
N$36
  Top 0.152: R19.1 13.93,24.6 13.54,24.2 U5.12
N$37
  Top 0.305: R15.1 10.73,21.43 11,21.69 U5.5
N$64
  Bottom 0.152: D15.14 D15.1 40.31,23.42 40.31,23.5 40.07,23.73 R60.1 40.16,23.86 40.89,24.59 40.89,26.16 41.38,26.65 J3.8
N$72
  Bottom 0.152: J3.1 41.12,18.95 40.42,19.66 D15.7 D15.8 39.06,18.84 R64.1
N$76
  Bottom 0.152: J3.7 41.81,25.55 41.4,25.15 41.4,23.88 40.94,23.41 40.94,22.41 40.69,22.16 D15.2 D15.13 38.67,22.16 38.1,22.73 R43.1
N$77
  Bottom 0.152: J3.5 42.78,23.37 41.78,23.37 41.45,23.03 41.45,22.04 41.07,21.66 D15.3 D15.12 38.5,21.66 38.31,21.85 R44.1
N$78
  Bottom 0.152: J3.3 D15.4 D15.11 38.84,21.16 38.68,21.31 38.15,21.31 37.85,21.01 R45.1
OLED_RST
  Top 0.152: D2.+ 27.01,14.38 C7.1 26.95,14.94 R21.1 26.95,17.43 30.86,21.34 32.74,21.34 33.75,22.34 | 33.75,22.34 33.76,22.35 33.76,22.48 U6.14 33.75,22.34
RESET
  Top 0.152: U2.15 4.19,19.6 4.19,7.24 7.34,4.09 K2.2
SWCLK  (via drill 0.25 pad 0.51)
  Top 0.152: v51.82,25.15 50.84,25.15 J7.1
  Bottom 0.152: U2.17 3.56,21.25 3.56,15.62 4.41,14.77 4.41,10.07 4.83,9.65 5.59,9.65 9.27,5.97 20.95,5.97 25.32,10.34 46.61,10.34 48.39,12.12 48.39,21.74 51.59,24.94 51.61,24.94 v51.82,25.15
SWDIO  (via drill 0.25 pad 0.51)
  Top 0.152: v51.82,24 51.44,24 50.67,23.24 J7.2
  Bottom 0.152: v51.82,24 48.84,21.03 48.84,11.89 46.86,9.91 25.4,9.91 21.08,5.59 9.14,5.59 5.46,9.27 4.7,9.27 4.06,9.91 4.06,14.61 3.17,15.49 3.17,19.09 U2.18
SYS_3V3  (via drill 0.25, 0.25 pad 0.51, 0.35)
  Top 0.152: 20.83,15.49 v20.95,15.37 | 56.37,30.51 56.59,30.72 56.59,30.86 | R2.2 56.29,35.03 56.59,34.74 56.59,30.86 | v56.4,30.48 56.4,30.67 56.59,30.86
  Top 0.254: 20.17,22.18 20.18,22.18 | R40.2 16.32,27.14 16.97,27.79 19.28,27.79 | 19.28,27.79 20.02,27.79 | 20.47,27.79 20.02,27.79 | 20.02,27.79 20.05,27.83 20.05,27.98 19.47,27.98 | 19.28,27.79 19.47,27.98 | 19.47,27.98 19.74,28.25 19.74,28.52
  Top 0.305: 20.7,7.72 20.75,7.67 | R10.2 R9.2 18.2,5.3 18.99,4.51 BUZ1.+
  Top 0.381: D4.+ v56.16,28.09 | R8.2 56.4,30.51 v56.4,30.48 | C24.2 34.8,8.64 | 34.8,8.64 C26.2 | 34.8,8.64 34.42,8.64 | 34.8,8.64 35.18,8.64 | C29.2 51.05,16.64 51.56,17.14 51.56,20.32 51.18,20.7 J7.3 | v34.06,33.68 34.21,33.53 C21.2 C20.2 34.22,34.16 v34.06,34.31
  Top 0.508: v23.19,12.49 23.19,13.14 FB1.1 23.2,13.13 v23.82,13.13
  Top 0.559: v20.75,8.79 20.7,8.84 20.14,8.84 v20.12,8.81 20.58,8.35 | 20.58,8.35 20.7,8.23 20.7,7.24 | 20.58,6.96 20.58,8.35 | 20.75,7.67 21.24,7.19 21.51,7.19
  Top 0.635: v20.95,15.37 20.95,20.57 | v20.07,21.46 20.47,21.06 | 20.47,21.06 20.95,20.57 | U2.12 J11.3 | 20.99,22.18 20.17,22.18 | 20.47,27.79 19.74,28.52 19.68,28.57 v19.68,34.29 | 20.55,27.71 21.46,26.8 21.46,23.42 | 21.46,23.42 21.46,22.66 20.99,22.18 | J6.3 38.17,7.37 36.83,7.37 35.56,8.64 35.18,8.64 | 20.8,7.19 20.58,6.96 20.58,6.22 20.58,5.72 19.75,4.89 19.68,4.83 19.37,4.51 BUZ1.+ 19.17,3.55 18.67,3.05 13.34,3.05 8.74,7.65 D5.- | 20.8,7.19 21.51,7.19 26.39,7.19 J5.3 29.61,7.19 32.72,7.19 34.16,8.64 34.42,8.64 | J7.3 49.23,20.7 47.87,22.06 47.87,27.18 | 47.87,27.18 47.87,27.7 | 47.87,27.7 47.87,29.74 47.14,30.47 44.93,30.47 J1.3 | 20.47,21.06 20.47,21.39 | 20.47,21.39 20.47,21.67 20.99,22.18 | 20.47,21.39 20.95,21.87 | 20.95,21.87 21.11,22.02 21.67,22.02 20.95,21.31 | 20.95,21.87 20.95,21.31 | 20.95,21.31 20.95,20.57 | C10.1 20.62,22.94 20.98,22.94 21.46,23.42 | 20.8,7.19 20.7,7.19 20.7,7.24 20.7,7.72 | v20.75,8.79 20.75,7.67 | D4.+ 55.08,27.52 54.74,27.18 48.39,27.18 | 48.39,27.18 47.87,27.18 | 47.87,27.7 48.39,27.18 | 48.39,27.18 47.88,26.67
  Bottom 0.305: v20.07,21.46 | 21.39,12.49 21.21,12.49 | 21.21,12.49 20.77,12.49 | 20.77,12.49 20.7,12.42 | v23.82,13.13 23.59,12.89 | 23.59,12.89 23.48,12.79 | 23.48,12.79 v23.19,12.49 | 21.09,13.13 20.86,13.13 20.71,12.98 | 20.7,12.97 20.88,12.79 | 23.48,12.79 21.23,12.79 | 21.23,12.79 20.88,12.79 | 20.88,12.79 20.98,12.89 23.59,12.89 | 21.23,12.79 20.7,12.25 20.7,11.99 | 21.21,12.49 20.7,11.99 | 20.7,11.99 20.7,11.81 | 20.77,12.49 20.71,12.55 20.71,13.51
  Bottom 0.381: v56.16,28.09 56.16,29.92 56.4,30.16 v56.4,30.48
  Bottom 0.559: 20.24,9.27 20.12,9.14 v20.12,8.81
  Bottom 0.635: 21.16,15.52 35.28,15.52 35.75,15.06 FB3.1 39.25,15.04 | v20.95,15.37 21.01,15.37 21.16,15.52 | 20.13,21.53 v20.07,21.46 | J1.3 41.6,34.31 40.4,35.51 30.62,35.51 30,34.89 | J4.3 30,34.89 | 30,34.89 29.28,35.61 29.01,35.61 | v20.95,15.37 20.71,15.13 20.71,13.87 | 20.71,13.51 20.71,12.98 20.7,12.97 20.7,12.42 20.7,11.81 20.75,11.76 v20.75,8.79 20.24,9.3 | 20.71,13.51 20.71,13.87 | v20.24,15.37 v20.95,15.37 | v20.24,15.37 20.24,13.26 | 20.24,13.26 20.24,11.58 | 20.24,11.58 20.24,9.3 | 20.24,9.27 20.24,9.3 | 21.16,15.52 20.4,15.52 v20.24,15.37 | v23.82,13.13 23.23,12.54 23.16,12.54 23.76,13.13 v23.82,13.13 | v23.82,13.13 21.09,13.13 20.71,13.51 | v23.19,12.49 21.69,12.49 | 21.69,12.49 21.39,12.49 | 21.39,12.49 21.01,12.49 20.24,13.26 | 21.39,12.49 20.48,11.58 20.24,11.58 | 20.71,13.87 21.69,12.89 21.69,12.49
  Bottom 0.762: 21.01,34.29 v19.68,34.29 10.49,34.29 J11.3
  other vias: 20.35,34.29
  pour Top (no thermals): 19.02,27.13 19.74,27.13 20.6,26.26 20.6,21.97 20.47,21.84 19.79,21.84 19.63,22 19.63,25.25 19.46,25.43 18.87,25.43 18.75,25.55 18.75,26.85
  pour Top (no thermals): 19.53,34.82 20.65,34.82 20.83,34.65 20.83,29.87 22.25,28.45 22.25,22.23 21.56,21.54 20.27,21.54 20.14,21.67 20.14,22.33 20.95,23.14 20.95,26.34 19.33,27.97 19.33,34.62
  pour Bottom (no thermals): 7.32,32.18 10.34,35.2 21.97,35.2 22.91,36.14 41.58,36.14 42.42,35.31 42.42,33.22 42.24,33.05 41.86,33.05 39.73,35.18 36.7,35.18 34.92,33.4 33.66,33.4 33.27,33.78 33.27,34.92 33.02,35.18 23.34,35.18 22.07,33.91 10.92,33.91 8.2,31.19 7.75,31.19 7.32,31.62
  pour Top: 19.68,22.89 19.68,15.16 19.96,14.88 21.13,14.88 21.23,14.99 21.23,22.83 20.95,23.11 19.91,23.11
USB_5V  (via drill 0.25 pad 0.51)
  Top 0.305: v13,19.89 12.88,19.77 R16.1
  Bottom 0.305: v13,19.89 11.76,19.89 11.63,19.76 9.78,19.76 9.27,19.76 9.13,19.9 8.61,20.42 8.61,21.23 8.61,23.39 v9.04,23.82
  pour Top (no thermals): 4.13,32.9 2.24,32.9 1.95,32.61 1.95,27.66 3.79,25.82 7.85,25.82 8,25.67 8,23.83 8.25,23.57 10.45,23.57 10.47,23.6 10.47,23.79 10.41,23.85 9.75,23.85 8.9,24.7 8.9,26.2 8.13,26.97 5.85,26.97 4.49,28.33 4.49,32.55
VBAT
  Top 0.254: 10.85,26.36 10.59,26.36 10.59,26.11 | 10.85,26.36 11.02,26.36 | 11.02,26.36 11.13,26.36 | 10.76,25.55 10.59,25.72 10.59,25.91 | 10.59,25.91 10.59,25.96 | 10.59,25.96 10.59,26.11 | 10.59,26.11 10.85,26.36 | 10.93,26.25 10.59,25.91 | 10.93,26.25 11.02,26.34 11.02,26.36 | 10.59,25.96 10.76,25.79 10.76,25.55 | 10.93,26.17 10.82,26.05 10.82,25.91 10.82,25.6 10.76,25.55 | 10.93,26.17 10.93,26.25 | 10.93,26.25 11.02,26.25 | 11.02,26.25 11.13,26.36 | 11.13,26.36 11.16,26.39 11.38,26.39 11.61,26.39 11.73,26.26 | 11.02,26.25 10.93,26.17 | 9.13,26.9 9.09,26.9 8.66,27.33
  Top 0.305: 6.86,32.89 6.86,28.35 7.62,27.58 8.79,27.58 9.35,27.03 9.82,26.56 10.02,26.56 | C25.1 10.58,25.99 10.2,26.37 | 10.2,26.37 10.02,26.56 | 10.59,26.11 10.49,26.21 10.01,26.21 9.79,26.43 | 10.59,25.91 10.2,26.3 10.2,26.37 | 10.02,26.56 11.44,26.56 11.73,26.26 11.94,26.06 12,26 12,25.5 U5.14 | 10.59,25.72 9.88,26.43 9.79,26.43 | 9.79,26.24 10.09,25.94 U5.16 11,25.31 10.76,25.55 | 9.79,26.24 9.79,26.43 | 9.79,26.24 9.13,26.9
  Top 0.33: 11,25.31 11.04,25.35 11.04,25.45 11.14,25.55 | 12,25.5 11.72,25.78 11.38,25.78 | 11.94,26.06 11.63,26.06 | 11.63,26.06 11.38,26.06 | 11.38,26.06 11.2,26.06 | 11.2,26.06 10.97,26.06 10.82,25.91 | 11.38,25.78 11.23,25.63 | 10.76,25.55 11.14,25.55 | 11.14,25.55 11.23,25.63 | 10.82,25.6 10.85,25.63 11.23,25.63 | 10.76,25.79 11.37,25.79 11.38,25.78 | 11.38,26.06 11.38,26.39 11.63,26.14 11.63,26.06 | 11.13,26.36 11.13,26.13 11.2,26.06 | 9.13,26.9 9.13,27.27 | 9.13,27.27 9.11,27.3 9.11,27.77 9.14,27.81 | 9.14,27.81 9.14,26.82 9.4,27.07 9.4,27.41 | 9.14,27.81 9.14,33.57 9.03,33.57 8.81,33.35 8.71,33.25 | 9.14,33.4 9.14,33.25 8.74,33.25 | 9.35,27.03 9.35,27.06 9.13,27.27 | 9.4,27.41 9.4,28.25 | 9.4,28.25 9.4,32.59 | 9.4,32.59 9.4,34.24 9.5,34.34 | 8.79,27.58 8.79,27.64 9.4,28.25 | 8.43,27.33 9.82,25.94 10.09,25.94 | 9.4,27.41 10.81,25.99 C25.1 | 7.21,33.25 6.86,32.89 | 8.71,33.25 7.7,33.25 | 8.71,33.25 8.74,33.25 | 8.74,33.25 9.4,32.59
  Top 0.381: 8.66,27.33 8.43,27.33 7.57,27.33 6.66,28.25 6.66,32.94 7.26,33.55 7.49,33.55
  Top 0.635: 9,33.85 7.79,33.85 7.49,33.55 7.7,33.35 8.81,33.35 | 7.7,33.25 7.21,33.25
  Top 0.889: 9,33.85 9,33.9 11.05,35.94 13.46,35.94 SW1.COM2
  Bottom 0.889: SW1.COM2 SW1.COM1
VBOOST_5V  (via drill 0.25 pad 0.51, 0.38 pad 0.51)
  Top 0.305: R5.1 10.09,17.83 7.29,17.83 6.99,17.53 | 6.73,9.93 7.39,9.27 7.47,9.27
  Top 0.381: 7.47,9.27 8.74,9.27 9.22,9.75 9.22,14.15 8.38,14.99 7.11,14.99 | 7.39,9.27 7.14,9.02 6.73,9.02
  Top 0.559: 6.73,9.93 6.73,14.99 6.86,14.99 7.11,14.99
  Top 0.635: C28.1 52.87,16.48 52.83,16.51 v52.83,16.89
  Top 0.889: J7.6 v53.85,20.7 | 6.73,9.93 6.73,9.02 6.73,6.58 v6.66,6.5 | 6.86,14.99 6.86,16.89 v6.99,17.02 6.99,17.53 | v7.42,5.99 7.21,5.99 6.73,6.48
  Bottom 0.635: 6.68,17.58 v6.99,17.58 v6.99,17.02
  Bottom 0.889: 50.8,16.89 50.8,11.02 44.22,4.45 10.29,4.45 9.73,4.45 8.64,4.45 | v52.83,16.89 51.56,16.89 | 51.56,16.89 50.8,16.89 | 50.8,16.89 50.8,17.66 | 50.8,17.66 50.8,19.3 52.2,20.7 v53.85,20.7 | 50.8,17.66 51.56,16.89 | 51.56,16.89 50.8,16.13 | 6.66,6.46 6.67,6.48
  pour Top (no thermals): 10.41,18.16 6.63,18.16 6.35,17.88 6.35,16.92 6.63,16.64 7.11,16.64 8,17.53 10.29,17.53 10.41,17.65
  pour Bottom (isolate 0.152, no thermals): 6.73,6.86 6.99,6.86 9.02,4.83 9.02,4.32 8.64,3.94 8.26,3.94 5.84,6.35 5.84,6.6 6.1,6.86
VDD_3V3_OLED  (via drill 0.25 pad 0.51)
  Top 0.305: R21.2 26.19,16.61 | R23.1 24.73,16.61 v24.89,16.76 | D2.- 24.77,13.73 | U6.9 30.26,22.32 | 30.26,22.32 30.48,22.1 | 30.48,22.1 31.37,22.1 31.66,22.39 U6.11 31.66,25.44 32.38,26.16 v35.18,26.16 | 30.26,22.32 30.26,21.88 | 30.26,21.88 26.19,17.8 26.19,16.92 | 30.26,21.88 30.48,22.1 | 26.19,16.92 26.19,16.61 | 26.19,16.61 v26.04,16.76 26.19,16.92
  Top 0.381: D2.- 24.7,13.02 25.02,12.7 27.3,12.7 27.81,13.21 v27.81,16.76
  Top 0.508: FB1.2 24.31,14.04 D2.-
  Bottom 0.305: R25.1 37.79,26.62 37.34,26.16 v35.18,26.16
  Bottom 0.381: v27.81,16.76 v26.04,16.76 v24.89,16.76
VDD_3V3_SD  (via drill 0.25 pad 0.51)
  Top 0.305: v36.58,18.29 36.7,18.41 v40.64,18.41 | v39.37,25.91 39.88,26.42 40.26,26.42 44.07,26.42 44.45,26.42 45.09,26.42 45.72,25.78 45.72,24.38 45.72,22.35 45.21,21.84 44.7,21.84 v44.07,21.84
  Bottom 0.254: R63.2 37,19.28 37.8,20.08 R62.2 | 39.3,23.87 R60.2 38.14,23.86 R61.2
  Bottom 0.305: R63.2 37,18.71 v36.58,18.29 | v40.64,18.41 40.25,18.41 R64.2 | v39.37,25.91 39.31,25.85 R60.2
  Bottom 0.381: R64.2 40.06,18.56 40.06,18.03 | 40.06,18.03 D1.2 | D1.2 40.06,17.4 | 40.06,17.4 C2.1 C3.1 40.06,15.12 FB3.2 | D1.2 40.37,17.73 | 40.39,17.73 41.27,17.73 43.51,17.73 43.88,18.1 44.07,18.29 44.07,20.95 v44.07,21.84 43.66,22.25 J3.4 | 40.06,18.03 40.37,17.73 | 40.37,17.73 40.39,17.73 | 40.39,17.73 40.06,17.4
VSYS  (via drill 0.25, 0.25 pad 0.51)
  Top 0.152: 6.69,22.72 4.02,25.4 3.61,25.4 1.54,27.47 1.54,32.88 2.21,33.55 5.69,33.55 8.17,36.03 D16.+
  Top 0.254: 10.06,24.2 U5.1 11.12,24.2 11.5,24.58 U5.15 | U3.5 16.34,22.43 v15.95,22.05
  Top 0.305: C14.1 9.27,15.69 | C16.2 11.85,15.71 C18.1 | U3.7 17.34,21.68 C15.2 17.84,21.66 U3.8
  Bottom 0.305: v15.95,22.05 15.95,20.83 16.74,20.04 | v17.55,19.61 17.17,19.61 16.74,20.04 | 16.74,20.04 16.74,19.28 | 16.74,20.04 17.5,20.04
  other vias: 7.44,19.71 6.73,19.08 6.73,19.68 9.58,24.66 9.35,25.17 18.44,19.63 10.08,24.87 18.44,20.32 9.53,14.94 8.99,15.85 9.08,15.3
  pour Top (no thermals): 7.54,22.96 6.6,22.96 6.48,22.83 6.48,18.97 6.76,18.69 7.34,18.69 7.7,19.05 7.7,22.81
  pour Bottom (no thermals): 10.01,25.5 8.71,25.5 7.04,23.83 7.04,21.44 6.45,20.85 6.45,19 7.05,18.4 8.26,19.61 8.26,23.57 9.02,24.33 10.08,24.33 10.24,24.49 10.24,25.27
  pour Top (no thermals): 17.25,22.38 17.25,19.56 17.48,19.33 18.54,19.33 18.72,19.51 18.72,21.36 17.7,22.38
  pour Bottom (no thermals): 6.45,20.45 6.45,18.64 6.9,18.2 7.73,18.2 8.29,17.64 8.29,15.23 8.83,14.69 9.71,14.69 9.84,14.82 9.84,17.66 10.13,17.96 17.17,17.96 18.72,19.51 18.72,20.42 18.57,20.57 17.6,20.57 16.36,19.33 9.3,19.33 8.08,20.55 6.55,20.55
  pour Top (no thermals): 12.93,16.1 8.39,16.1 8.13,15.84 8.13,15.36 8.78,14.71 13.21,14.71 13.97,15.47 18.8,15.47 19.38,16.05 19.38,16.97 19.2,17.14 18.08,17.14 17.6,16.66 13.49,16.66
  pour Top (no thermals): 9.22,25.45 10.06,25.45 10.26,25.25 10.26,24.08 9.78,24.08 9.09,24.77 9.09,25.32

### Text on the board
tNames: IIC | IIC | ON | OFF | USB5V | G | 3V3 | 10 | 9 | 8 | 7 | SCL | · | 5 | SDA | · | 4 | 3V3 | GND | SCL | · | 5 | SDA | · | 4 | 3V3 | GND | 7 | 1 | 30 | SWCLK | · | RX | GND | 6 | · | SWCLK | SWDIO | TX | 3V3 | 5V | SWDIO | GND | GND | - | RESET | GND | 3V3 | N/A | 0 | GND | 3V3 | TX | · | 6 | RX | · | 7 | 0 | 1 | 2 | 3 | 4 | 5 | 6 | Buzzer(A3) | + | RESET | Button(D1) | A0 | · | D0 | UART
bNames: ·
tTest: JP3
Reference: JP3 | JP4 | JP5 | JP6